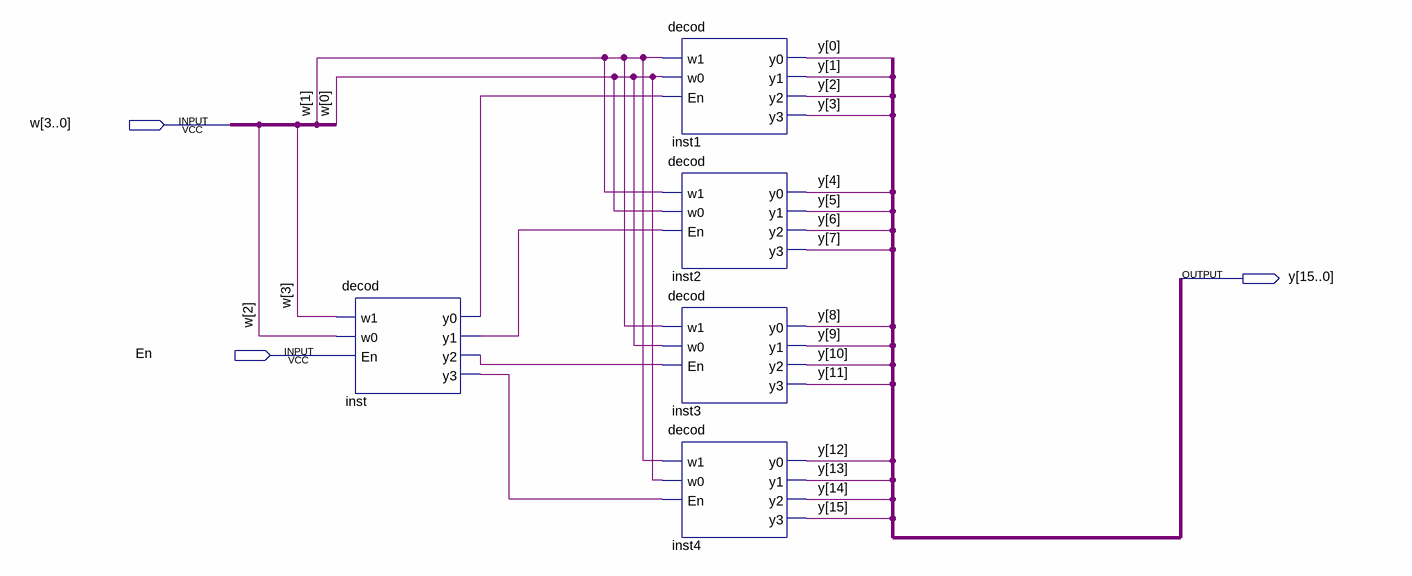
[diagram p0: schematic sheet]
// Quartus schematic 4to16Decod.bdf as structural Verilog: 5 symbols, 3 pins
module \4to16Decod  (
  input  [3:0] w,
  input  En,
  output [15:0] y
);

  wire inst_y0, inst_y1, inst_y2, inst_y3;

  decod inst (.w1(w[3]), .w0(w[2]), .En(En), .y0(inst_y0), .y1(inst_y1), .y2(inst_y2), .y3(inst_y3));
  decod inst1 (.w1(w[1]), .w0(w[0]), .En(inst_y0), .y0(y[0]), .y1(y[1]), .y2(y[2]), .y3(y[3]));
  decod inst2 (.w1(w[1]), .w0(w[0]), .En(inst_y1), .y0(y[4]), .y1(y[5]), .y2(y[6]), .y3(y[7]));
  decod inst3 (.w1(w[1]), .w0(w[0]), .En(inst_y2), .y0(y[8]), .y1(y[9]), .y2(y[10]), .y3(y[11]));
  decod inst4 (.w1(w[1]), .w0(w[0]), .En(inst_y3), .y0(y[12]), .y1(y[13]), .y2(y[14]), .y3(y[15]));
endmodule
